# EAGLE design tactor (EAGLE 5.12)
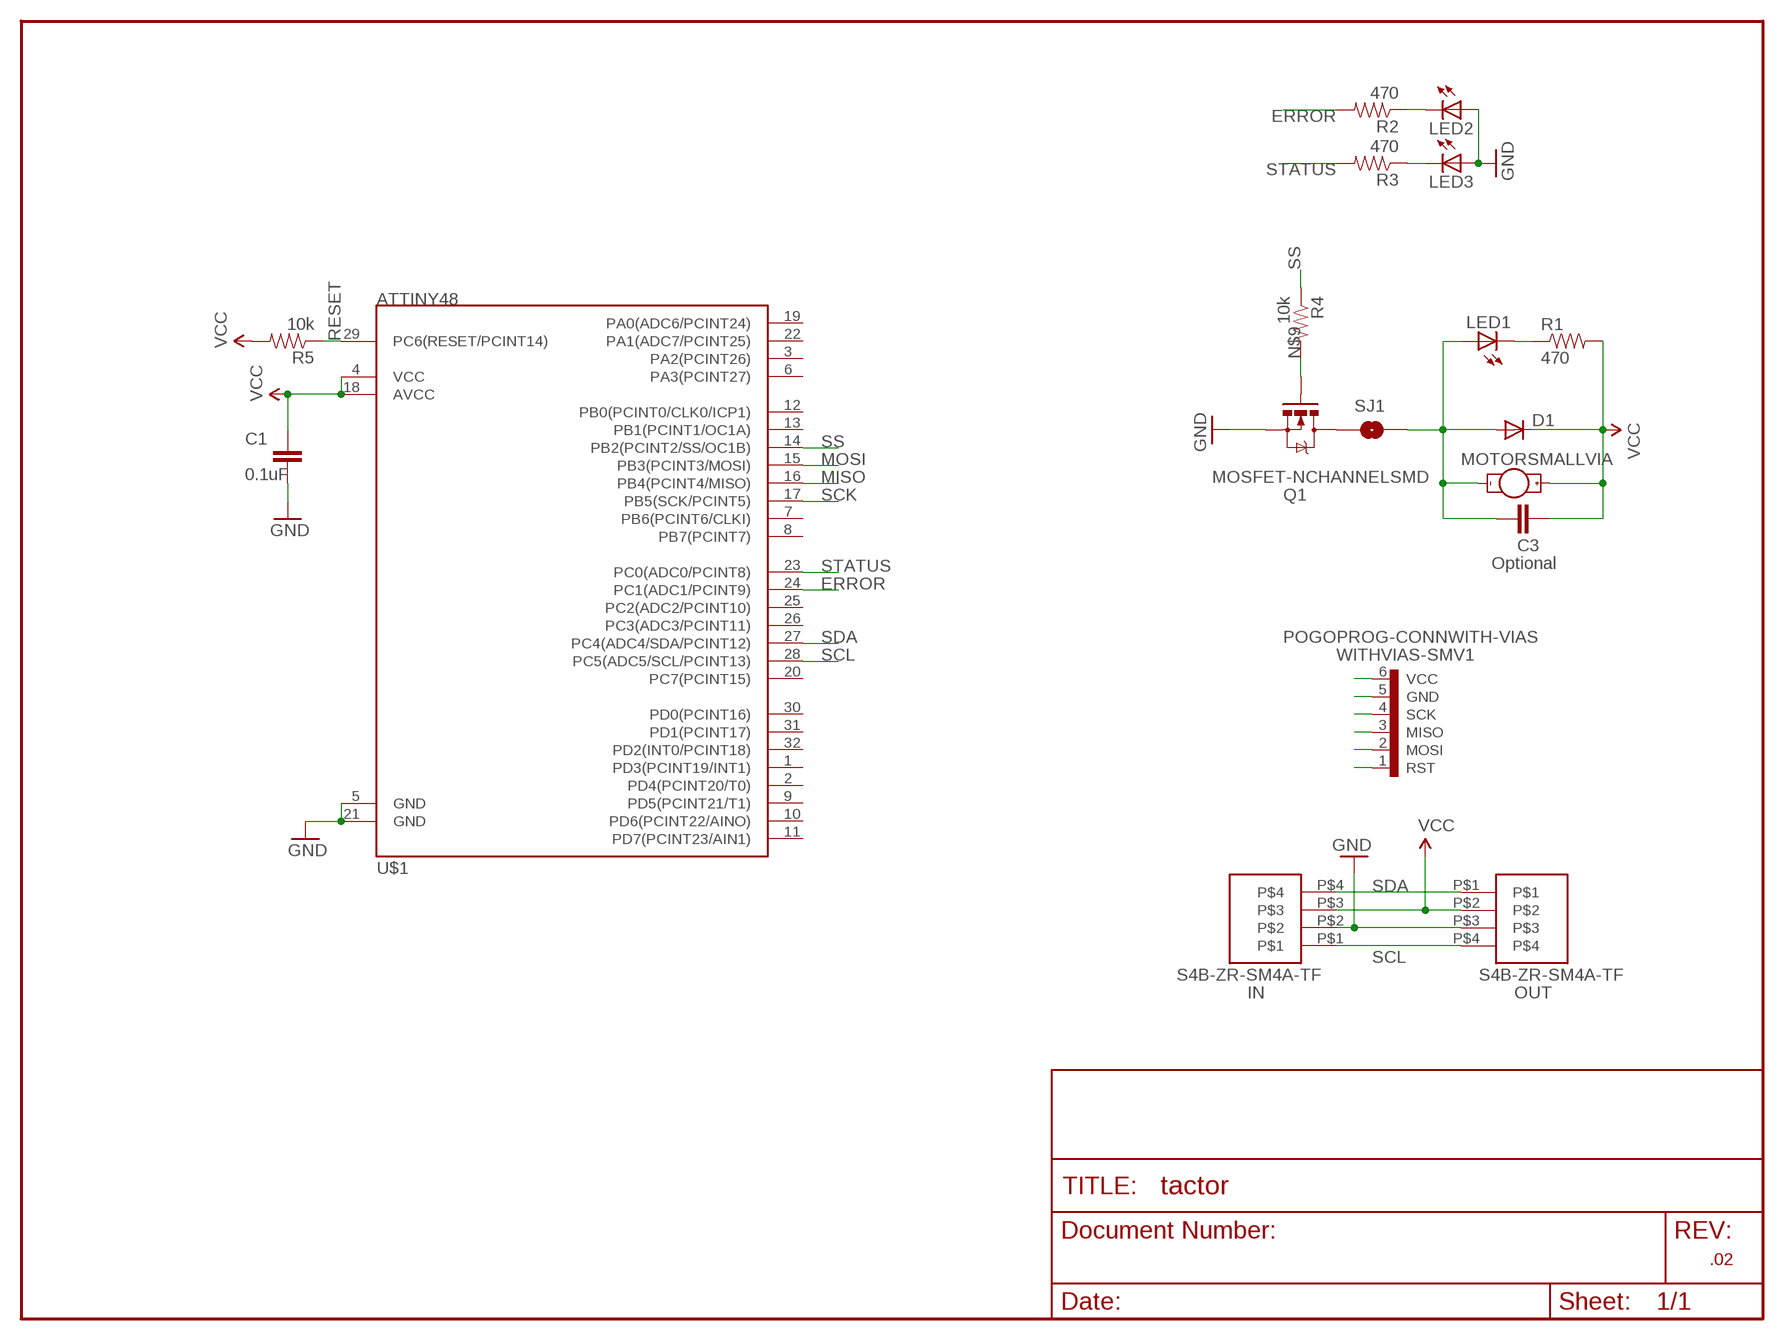
[diagram p0: schematic, sheet 1]

## Parts
C1  0.1uF  CAP0805  [0805]
C3  Optional  CAP0805  [0805]
D1  DIODE-SOD123  [SOD123]
IN  S4B-ZR-SM4A-TF  [S4B-ZR-SM4A-TF]
LED1  LEDCHIP-LED0805  [CHIP-LED0805]
LED2  LEDCHIP-LED0805  [CHIP-LED0805]
LED3  LEDCHIP-LED0805  [CHIP-LED0805]
OUT  S4B-ZR-SM4A-TF  [S4B-ZR-SM4A-TF]
Q1  MOSFET-NCHANNELSMD  [SOT23-3]
R1  470  RESISTOR  [0805]
R2  470  RESISTOR  [0805]
R3  470  RESISTOR  [0805]
R4  10k  RESISTOR  [0805]
R5  10k  RESISTOR  [0805]
SJ1  SOLDERJUMPER0603  [0603-TRACE]
U$1  ATTINY48  [TQFP32-08]
U$6  MOTORSMALLVIA  [VIBE-MOTOR-10MM-SMALLVIA]
WITHVIAS-SMV1  POGOPROG-CONNWITH-VIAS  [POGOPROG-CONN-SMALLERVIAS]

## Nets
ERROR: R2.2 U$1.24(PC1(ADC1/PCINT9))
GND: C1.2 IN.P$2 LED2.A LED3.A OUT.P$3 Q1.2(S) U$1.5(GND) U$1.21(GND) WITHVIAS-SMV1.5(GND)
MISO: U$1.16(PB4(PCINT4/MISO)) WITHVIAS-SMV1.3(MISO)
MOSI: U$1.15(PB3(PCINT3/MOSI)) WITHVIAS-SMV1.2(MOSI)
N$1: Q1.3(D) SJ1.1
N$3: C3.1 D1.A LED1.A SJ1.2 U$6.-
N$4: LED2.C R2.1
N$5: LED3.C R3.1
N$6: LED1.C R1.1
N$9: Q1.1(G) R4.2
RESET: R5.1 U$1.29(PC6(RESET/PCINT14)) WITHVIAS-SMV1.1(RST)
SCK: U$1.17(PB5(SCK/PCINT5)) WITHVIAS-SMV1.4(SCK)
SCL: IN.P$1 OUT.P$4 U$1.28(PC5(ADC5/SCL/PCINT13))
SDA: IN.P$4 OUT.P$1 U$1.27(PC4(ADC4/SDA/PCINT12))
SS: R4.1 U$1.14(PB2(PCINT2/SS/OC1B))
STATUS: R3.2 U$1.23(PC0(ADC0/PCINT8))
VCC: C1.1 C3.2 D1.C IN.P$3 OUT.P$2 R1.2 R5.2 U$1.4(VCC) U$1.18(AVCC) U$6.+ WITHVIAS-SMV1.6(VCC)
Unconnected: U$1.1(PD3(PCINT19/INT1)) U$1.2(PD4(PCINT20/T0)) U$1.3(PA2(PCINT26)) U$1.6(PA3(PCINT27)) U$1.7(PB6(PCINT6/CLKI)) U$1.8(PB7(PCINT7)) U$1.9(PD5(PCINT21/T1)) U$1.10(PD6(PCINT22/AINO)) U$1.11(PD7(PCINT23/AIN1)) U$1.12(PB0(PCINT0/CLK0/ICP1)) U$1.13(PB1(PCINT1/OC1A)) U$1.19(PA0(ADC6/PCINT24)) U$1.20(PC7(PCINT15)) U$1.22(PA1(ADC7/PCINT25)) U$1.25(PC2(ADC2/PCINT10)) U$1.26(PC3(ADC3/PCINT11)) U$1.30(PD0(PCINT16)) U$1.31(PD1(PCINT17)) U$1.32(PD2(INT0/PCINT18))

## Notes on the sheet
- .02

## Library data of the parts
C1 C3 = SparkFun:CAP: Capacitor Standard 0603 ceramic capacitor, and 0.1" leaded capacitor.
D1 = diode:DIODE-: DIODE
IN OUT = cubic:S4B-ZR-SM4A-TF: B4B-ZR-SM4-TF JST ZH 4pin side entry solder tab
LED1-LED3 = adafruit:LED: LED OSRAM: - CHIPLED LG R971, LG N971, LY N971, LG Q971, LY Q971, LO R971, LY R971 LH N974, LH R974 LS Q976, LO Q976, LY Q976 LO Q996 - Hyper CHIPLED LW Q18S LB Q993, LB Q99A, LB R99A - SideLED LS A670, LO A670, LY A670, LG A670, LP A670 LB A673, LV A673, LT A673, LW A673 LH A674 LY A675 LS A676, LA A676, LO A676, LY A676, LW A676 LS A679, LY A679, LG A679 - Hyper Micro SIDELED® LS Y876, LA Y876, LO Y876, LY Y876 LT Y87S - SmartLED LW L88C, LW L88S LB L89C, LB L89S, LG L890 LS L89K, LO L89K, LY L89K LS L896, LA L896, LO L896, LY L896 - TOPLED LS T670, LO T670, LY T670, LG T670, LP T670 LSG T670, LSP T670, LSY T670, LOP T670, LYG T670 LG T671, LOG T671, LSG T671 LB T673, LV T673, LT T673, LW T673 LH T674 LS T676, LA T676, LO T676, LY T676, LB T676, LH T676, LSB T676, LW T676 LB T67C, LV T67C, LT T67C, LS T67K, LO T67K, LY T67K, LW E67C LS E67B, LA E67B, LO E67B, LY E67B, LB E67C, LV E67C, LT E67C LW T67C LS T679, LY T679, LG T679 LS T770, LO T770, LY T770, LG T770, LP T770 LB T773, LV T773, LT T773, LW T773 LH T774 LS E675, LA E675, LY E675, LS T675 LS T776, LA T776, LO T776, LY T776, LB T776 LHGB T686 LT T68C, LB T68C - Hyper Mini TOPLED® LB M676 - Mini TOPLED Santana® LG M470 LS M47K, LO M47K, LY M47K Source: http://www.osram.convergy.de/
Q1 = SparkFun:MOSFET-NCHANNEL
R1-R5 = SparkFun:RESISTOR: Resistor Basic schematic elements and footprints for 0603, 1206, and PTH 1/10th watt (small) resistors.
SJ1 = jjr:SOLDERJUMPER: Solder Jumper Solder jumper designed around an 0805 pad so you can drop in a component if you cut the trace. Normally Closed
U$1 = jjr:ATTINY48: ATTINY48 ATMEL
U$6 = jjr:MOTOR: Vibration Motor Physical dimension and wire connections for this powerful vibration motor. Motor has a self adhesive backing. Spark Fun Electronics SKU : ROB-08449
WITHVIAS-SMV1 = pogoProg-eagle5:POGOPROG-CONN

## Board
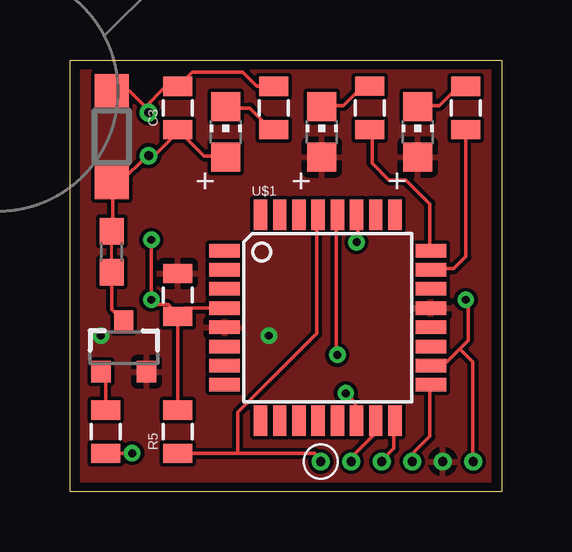
[diagram p1: board, top side]
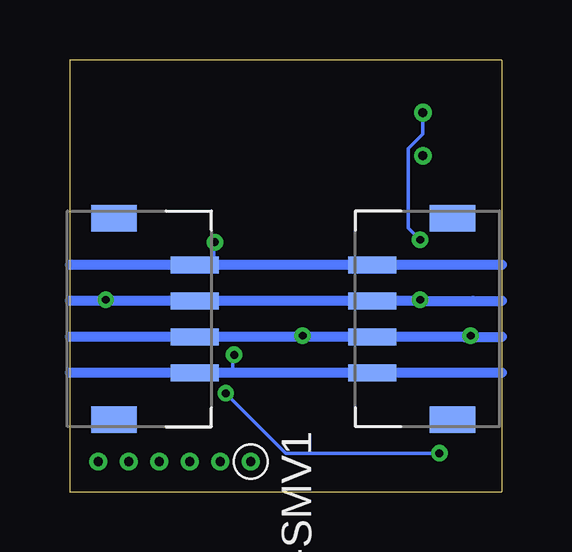
[diagram p2: board, bottom side, seen from below]

Size 18 x 18 mm. Coordinates in mm from the lower left corner, seen from the top.
Outline: 18,0 0,0 0,18 18,18 18,0
Copper layers (1*16): Top 0.0356mm / dielectric 1.5011mm / Bottom 0.0356mm
Design rules "LaenPCBOrder": minimum track width 6mil, minimum drill 13mil, track to track 6mil, track to pad 6mil, pad to pad 6mil, via to via 6mil, smd to smd 6mil, copper to edge 15mil, drill to drill 6mil, minimum pad ring 7mil, minimum via ring 7mil, stop-mask expansion 4mil, vias tented up to drill 0mil, thermal gap 10mil

### Footprints (pad centres in the part's own frame; a part is rotated, then mirrored left to right if it is on the bottom)
0805 = smd 0.8 x 1.2: 1 -0.9,0; 2 0.9,0
SOD123 = smd 1.4 x 1.4: A 1.9,0; C -1.9,0
S4B-ZR-SM4A-TF = smd 0.7 x 2: P$1 -2.25,-2.3; P$2 -0.75,-2.3; P$3 0.75,-2.3; P$4 2.25,-2.3 | smd 1.1 x 1.9: P$5 -4.2,1.05; P$6 4.2,1.05
CHIP-LED0805 = smd 1.2 x 1.2: A 0,-1.05; C 0,1.05
SOT23-3 = smd 0.8 x 0.9: 1 -0.95,-1; 2 0.95,-1; 3 0,1.1
0603-TRACE = smd 1.1 x 1: 1 -0.85,0; 2 0.85,0
TQFP32-08 = smd 1.27 x 0.559: 1 -4.293,2.8; 2 -4.293,2; 3 -4.293,1.2; 4 -4.293,0.4; 5 -4.293,-0.4; 6 -4.293,-1.2; 7 -4.293,-2; 8 -4.293,-2.8; 17 4.293,-2.8; 18 4.293,-2; 19 4.293,-1.2; 20 4.293,-0.4; 21 4.293,0.4; 22 4.293,1.2; 23 4.293,2; 24 4.293,2.8 | smd 0.559 x 1.27: 9 -2.8,-4.293; 10 -2,-4.293; 11 -1.2,-4.293; 12 -0.4,-4.293; 13 0.4,-4.293; 14 1.2,-4.293; 15 2,-4.293; 16 2.8,-4.293; 25 2.8,4.293; 26 2,4.293; 27 1.2,4.293; 28 0.4,4.293; 29 -0.4,4.293; 30 -1.2,4.293; 31 -2,4.293; 32 -2.8,4.293
VIBE-MOTOR-10MM-SMALLVIA = drill 0.381 round: + -5.08,-3.81; - -6.35,-2.54
POGOPROG-CONN-SMALLERVIAS = drill 0.381 round: 1 0,2.54; 2 0,1.27; 3 0,0; 4 0,-1.27; 5 0,-2.54; 6 0,-3.81

### Placement (x,y rotation side)
C1  4.5,8.2 90 top
C3  4.5,16 90 top
D1  1.75,14.8 270 top
IN  15.1,7.2 90 bottom
LED1  6.5,15 0 top
LED2  10.5,15 0 top
LED3  14.5,15 0 top
OUT  3.1,7.2 270 bottom
Q1  2.25,6 0 top
R1  8.5,16 90 top
R2  12.5,16 270.1 top
R3  16.5,16 270 top
R4  1.5,2.5 90 top
R5  4.5,2.5 90 top
SJ1  1.75,10 90 top
U$1  10.75,7.25 0 top
U$6  -3,16.7 135 top
WITHVIAS-SMV1  13,1.25 270 bottom

### Tracks (layer width: path | path; a pad name or v marks a point on that pad's centre or on a via)
ERROR
  Top 0.152: R2.2 12.6,15.1 12.6,13.7 13.3,13 14,13 15,12 15,10.1 U$1.24
GND  (via drill 0.33)
  Bottom 0.152: 1.6,6.4 1.6,6.45 v1.3,6.5
  Bottom 0.406: 18,6.45 IN.P$2 OUT.P$3 1.6,6.45 0,6.45
  other vias: 8.3,6.5
  pour Top: 17.5,18 17.5,0 0.5,0 0.5,18
MISO
  Top 0.152: U$1.16 13.5,2.9 13.5,1.8 13,1.3 WITHVIAS-SMV1.3
MOSI
  Top 0.152: U$1.15 12.7,2.9 12.7,2.4 11.8,1.5 11.8,1.3 WITHVIAS-SMV1.2
N$1
  Top 0.152: Q1.3 1.75,7.6 SJ1.1
N$3
  Top 0.152: LED1.A 6.5,14 5.6,14 C3.1 4.5,15 3.6,14.1 3.3,14.1 U$6.- 3.2,14 2.1,12.9 | 1.8,12.9 2.1,12.9 | 2.1,12.9 2.4,12.9 | 1.8,12.9 1.8,10.9 SJ1.2 | 1.8,12.9 D1.A
N$4
  Top 0.152: LED2.C 10.5,16.1 11.4,16.1 12.1,16.8 12.4,16.8 R2.1
N$5
  Top 0.152: R3.1 16.2,16.9 15.4,16.1 14.5,16.1 LED3.C
N$6
  Top 0.152: R1.1 8.4,15.1 7.5,16 6.5,16 LED1.C
N$9
  Top 0.152: R4.2 1.5,5 Q1.1
RESET
  Top 0.152: 7,1.6 10.2,1.6 10.5,1.3 WITHVIAS-SMV1.1 | 7,1.6 7,3.3 10.3,6.6 10.3,11.5 U$1.29 | R5.1 7,1.6
SCK
  Top 0.152: U$1.17 15,4.4 15,2.3 14.3,1.6 14.3,1.3 WITHVIAS-SMV1.4
SCL  (via drill 0.33)
  Top 0.152: U$1.28 11.1,11.5 11.1,5.7 v11.15,5.7
  Bottom 0.152: v11.15,5.7 11.2,5.7 11.2,4.95
  Bottom 0.406: 0,4.95 OUT.P$4 11.2,4.95 IN.P$1 18,4.95
SDA  (via drill 0.33)
  Top 0.152: U$1.27 12,11.5 12,10.4 v11.95,10.4
  Bottom 0.152: IN.P$4 13.2,9.6 | IN.P$4 12.7,9.6 | IN.P$4 12.2,9.6 | v11.95,10.4 12,10.4 12,9.6 IN.P$4
  Bottom 0.406: 0,9.45 OUT.P$1 IN.P$4 18,9.45
SS  (via drill 0.33)
  Top 0.152: R4.1 v2.6,1.6 | v11.5,4.1 11.9,3.7 11.9,3 U$1.14
  Bottom 0.152: v2.6,1.6 9,1.6 v11.5,4.1
STATUS
  Top 0.152: R3.2 16.5,9.8 16,9.3 15.1,9.3 U$1.23
VCC  (via drill 0.33)
  Top 0.152: 16.25,5.95 16.6,6.3 16.6,7.9 v16.5,8 | 16.25,5.95 15.6,5.3 15.1,5.3 U$1.18 | 16.25,5.95 16.8,5.4 16.8,1.3 WITHVIAS-SMV1.6 | R1.2 7.8,16.9 7.2,17.5 5.1,17.5 C3.2 4.5,16.8 3.9,16.8 3.2,16.1 U$6.+ 3.3,15.9 2.5,16.7 D1.C | 6.4,7.7 U$1.4 4.8,7.65 C1.1 | R5.2 C1.1 | C1.1 4.5,7.4 4.1,7.8 3.6,7.8 v3.4,8 v3.4,10.5
  Bottom 0.152: 7.9,7.95 7.9,8 | OUT.P$2 5.08,8.12 | 1.2,7.95 1.2,8 | v3.4,8 3.5,7.95 | 17,7.95 v16.5,8 | 18,7.95 18.1,8.1 | v3.4,10.5 3.9,11 3.9,14.3 3.3,14.9 U$6.+
  Bottom 0.406: 18,7.95 17,7.95 IN.P$3 7.9,7.95 OUT.P$2 3.5,7.95 1.2,7.95 0,7.95

### Text on the board
_tNames: C3 | R1 | R2 | R3 | Motor | Error | Status | D1 | C1 | Q1 | R4 | R5
_bNames: CUbiC | Tactor | rev .02 | OUT | IN